# Altium schematic sheet Power_REF_2V5.SchDoc: 2.5V Reference
size Letter; Engineer: Nathan Petersen; DocumentNumber: 10; Revision: v1.2; SheetNumber: 10; SheetTotal: 30
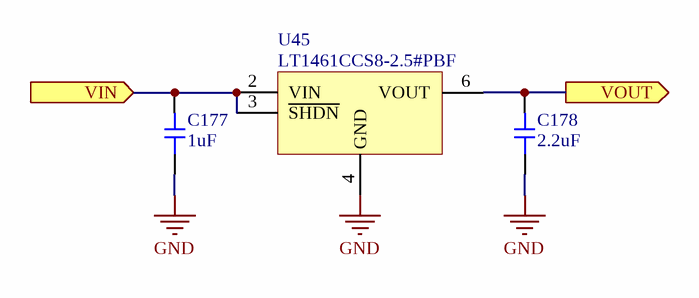
[diagram p0: Power_REF_2V5.SchDoc]

## Parts
C177  value 1uF  [0603-CAP]  (hidden comment: Capacitor)
C178  value 2.2uF  [0603-CAP]  (hidden comment: Capacitor)
U45  LT1461CCS8-2.5#PBF  [SOIC8_N]

## Ports
VIN (in), VOUT (out)

## Nets
GND: C177.2 C178.2 U45.4(GND)
VIN: C177.1 U45.2(VIN) U45.3(~{SHDN}) ; port VIN
VOUT: C178.1 U45.6(VOUT) ; port VOUT

## Notes on the sheet
- Title:
- File:
- Sheet:
- of
- Revision:
- Time:
- Date:
- Engineer:

## Library data of the parts
C177 = Capacitor: Manufacturer: Samsung; Manufacturer Part Number: CL10B105MO8NNWC; Voltage Rating: 16V; Tolerance: 20%; Supplier 1: Digi-Key; Supplier Part Number 1: 1276-6524-6-ND; Stock 1: 40000; Pricing 1: 1=0.1, 10=0.032, 100=0.0142, 500=0.01016, 1000=0.00798 (USD); Mount: Surface Mount; Case/Package: 0603; Case Code (Metric): 1608; Case Code (Imperial): 0603; Min Operating Temperature: -55°C; Max Operating Temperature: 125°C; Packaging: Tape and Reel; Capacitance: 1uF; Length: 0.063inch; Width: 0.031inch; Thickness: 0.035inch; ComponentLink1URL: http://www.samsungsem.com/kr/support/product-search/mlcc/CL10B105MO8NNWC.jsp; ComponentLink1Description: http://www.samsungsem.com/kr/support/product-search/mlcc/CL10B105MO8NNWC.jsp
C178 = Capacitor: Manufacturer: Murata; Manufacturer Part Number: GRM188R6YA225MA12D; Voltage Rating: 35V; Tolerance: 20%; Dielectric: X5R; Supplier 1: Digi-Key; Supplier Part Number 1: 490-10486-6-ND; Stock 1: 30635; Pricing 1: 1=0.21, 10=0.142, 100=0.0721, 500=0.04934, 1000=0.04364 (USD); Mount: Surface Mount; Case/Package: 0603; Weight: 0.000222oz; Case Code (Metric): 1608; Case Code (Imperial): 0603; Min Operating Temperature: -55°C; Max Operating Temperature: 85°C; Capacitance: 2.2uF; Packaging: Tape and Reel; Termination: SMD/SMT; Voltage Rating (DC): 35V; Package Quantity: 4000; Length: 0.063inch; Height: 0.8mm; Width: 0.031inch; Thickness: 0.035inch; ComponentLink1URL: http://search.murata.co.jp/Ceramy/image/img/A01X/G101/ENG/GRM188R6YA225MA12-01.pdf; ComponentLink1Description: http://search.murata.co.jp/Ceramy/image/img/A01X/G101/ENG/GRM188R6YA225MA12-01.pdf; ComponentLink2URL: http://search.murata.co.jp/Ceramy/image/img/A01X/partnumbering_e_01.pdf; ComponentLink2Description: http://search.murata.co.jp/Ceramy/image/img/A01X/partnumbering_e_01.pdf; ComponentLink3URL: http://www.mouser.com/ds/2/281/c02e-2905.pdf; ComponentLink3Description: http://www.mouser.com/ds/2/281/c02e-2905.pdf
U45 = LT1461CCS8-2.5#PBF: IC VREF SERIES 2.5V 8SOIC; Manufacturer: Analog Devices / Linear Technology; Tolerance: 0.08%; Output Current: 100mA; Min Input Voltage: 3V; Max Input Voltage: 20V; Temperature Coefficient: 12ppm/°C; Operating Supply Current: 70uA; Quiescent Current: 50uA; Output Type: Fixed; Supplier 1: Digi-Key; Supplier Part Number 1: LT1461CCS8-2.5#PBF-ND; Manufacturer Part Number: LT1461CCS8-2.5#PBF; Stock 1: 1659; Pricing 1: 1=3.08, 25=2.042, 100=1.785 (USD); Mount: Surface Mount; Case/Package: SOIC; Number of Pins: 8; Min Operating Temperature: 0°C; Max Operating Temperature: 70°C; Package Quantity: 100; Packaging: Rail/Tube; Min Output Voltage: 2.5V; Max Output Voltage: 2.5V; Reference Voltage: 2.5V; Output Voltage: 2.5V; Reference Type: Series; REACH SVHC: No SVHC; Lead Free: Lead Free; ComponentLink1URL: https://datasheet.ciiva.com/2008/1342-2008918.pdf; ComponentLink1Description: https://datasheet.ciiva.com/2008/1342-2008918.pdf; ComponentLink2URL: https://datasheet.ciiva.com/7003/1599656-7003304.pdf; ComponentLink2Description: https://datasheet.ciiva.com/7003/1599656-7003304.pdf; ComponentLink3URL: https://datasheet.ciiva.com/8041/1599656-8041704.pdf; ComponentLink3Description: https://datasheet.ciiva.com/8041/1599656-8041704.pdf; ComponentLink4URL: https://datasheet.ciiva.com/19474/1736562-19474044.pdf; ComponentLink4Description: https://datasheet.ciiva.com/19474/1736562-19474044.pdf; ComponentLink5URL: https://datasheet.ciiva.com/5698/1599656-5698223.pdf; ComponentLink5Description: https://datasheet.ciiva.com/5698/1599656-5698223.pdf